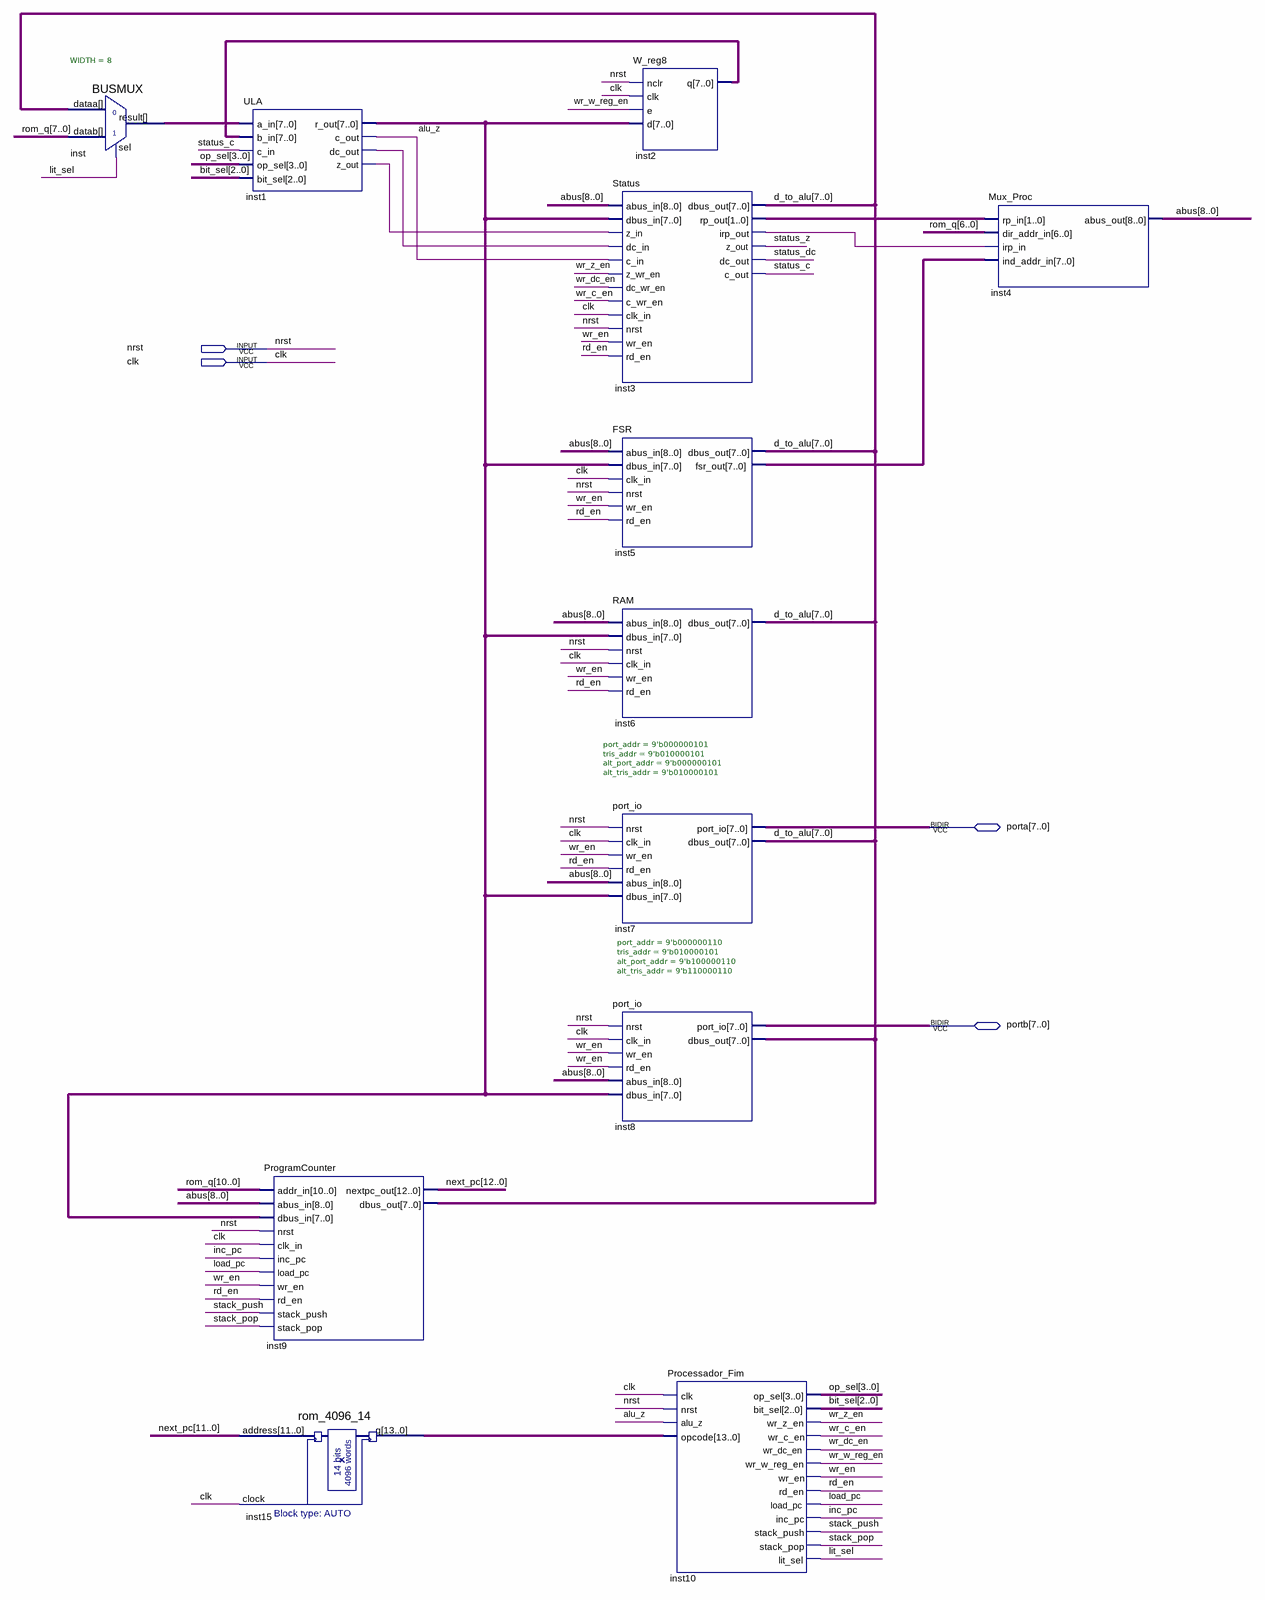
[diagram p0: schematic sheet]
// Quartus schematic Trabalho_final.bdf as structural Verilog: 12 symbols, 4 pins
module Trabalho_final (
  input  nrst,
  input  clk,
  inout  [7:0] porta,
  inout  [7:0] portb
);

  wire alu_z, inc_pc, inst1_c_out, inst1_dc_out, inst1_z_out, inst3_irp_out, lit_sel, load_pc, rd_en,
       stack_pop, stack_push, status_c, status_dc, status_z, wr_c_en, wr_dc_en, wr_en, wr_w_reg_en, wr_z_en;
  wire [1:0] inst3_rp_out;
  wire [2:0] bit_sel;
  wire [3:0] op_sel;
  wire [7:0] d_to_alu, inst2_q, inst5_fsr_out, inst_result;
  wire [8:0] abus;
  wire [10:0] rom_q;
  wire [12:0] next_pc;
  wire [13:0] inst15_q;

  BUSMUX #(.WIDTH(8)) inst (.datab(rom_q[7:0]), .sel(lit_sel), .dataa(d_to_alu), .result(inst_result));
  ULA inst1 (
    .a_in(inst_result), .b_in(inst2_q), .c_in(status_c), .op_sel(op_sel), .bit_sel(bit_sel), .r_out(alu_z),
    .c_out(inst1_c_out), .dc_out(inst1_dc_out), .z_out(inst1_z_out));
  ProgramCounter inst9 (
    .addr_in(rom_q), .abus_in(abus), .dbus_in({8{alu_z}}), .nrst(nrst), .clk_in(clk), .inc_pc(inc_pc),
    .load_pc(load_pc), .wr_en(wr_en), .rd_en(rd_en), .stack_push(stack_push), .stack_pop(stack_pop),
    .nextpc_out(next_pc), .dbus_out(d_to_alu));
  rom_4096_14 inst15 (.address(next_pc[11:0]), .clock(clk), .q(inst15_q));
  W_reg8 inst2 (.nclr(nrst), .clk(clk), .e(wr_w_reg_en), .d({8{alu_z}}), .q(inst2_q));
  Status inst3 (
    .abus_in(abus), .dbus_in({8{alu_z}}), .z_in(inst1_z_out), .dc_in(inst1_dc_out), .c_in(inst1_c_out),
    .z_wr_en(wr_z_en), .dc_wr_en(wr_dc_en), .c_wr_en(wr_c_en), .clk_in(clk), .nrst(nrst), .wr_en(wr_en),
    .rd_en(rd_en), .dbus_out(d_to_alu), .rp_out(inst3_rp_out), .irp_out(inst3_irp_out), .z_out(status_z),
    .dc_out(status_dc), .c_out(status_c));
  FSR inst5 (
    .abus_in(abus), .dbus_in({8{alu_z}}), .clk_in(clk), .nrst(nrst), .wr_en(wr_en), .rd_en(rd_en),
    .dbus_out(d_to_alu), .fsr_out(inst5_fsr_out));
  RAM inst6 (
    .abus_in(abus), .dbus_in({8{alu_z}}), .nrst(nrst), .clk_in(clk), .wr_en(wr_en), .rd_en(rd_en),
    .dbus_out(d_to_alu));
  port_io #(.port_addr(9'b000000101), .tris_addr(9'b010000101), .alt_port_addr(9'b000000101), .alt_tris_addr(9'b010000101)) inst7 (
    .nrst(nrst), .clk_in(clk), .wr_en(wr_en), .rd_en(rd_en), .abus_in(abus), .dbus_in({8{alu_z}}),
    .dbus_out(d_to_alu), .port_io(porta));
  port_io #(.port_addr(9'b000000110), .tris_addr(9'b010000101), .alt_port_addr(9'b100000110), .alt_tris_addr(9'b110000110)) inst8 (
    .nrst(nrst), .clk_in(clk), .wr_en(wr_en), .rd_en(wr_en), .abus_in(abus), .dbus_in({8{alu_z}}),
    .dbus_out(d_to_alu), .port_io(portb));
  Processador_Fim inst10 (
    .clk(clk), .nrst(nrst), .alu_z(alu_z), .opcode(inst15_q), .op_sel(op_sel), .bit_sel(bit_sel),
    .wr_z_en(wr_z_en), .wr_c_en(wr_c_en), .wr_dc_en(wr_dc_en), .wr_w_reg_en(wr_w_reg_en), .wr_en(wr_en),
    .rd_en(rd_en), .load_pc(load_pc), .inc_pc(inc_pc), .stack_push(stack_push), .stack_pop(stack_pop),
    .lit_sel(lit_sel));
  Mux_Proc inst4 (
    .rp_in(inst3_rp_out), .dir_addr_in(rom_q[6:0]), .irp_in(inst3_irp_out), .ind_addr_in(inst5_fsr_out),
    .abus_out(abus));
endmodule
